# EAGLE design ML_Interface_B (EAGLE 9.2.2)
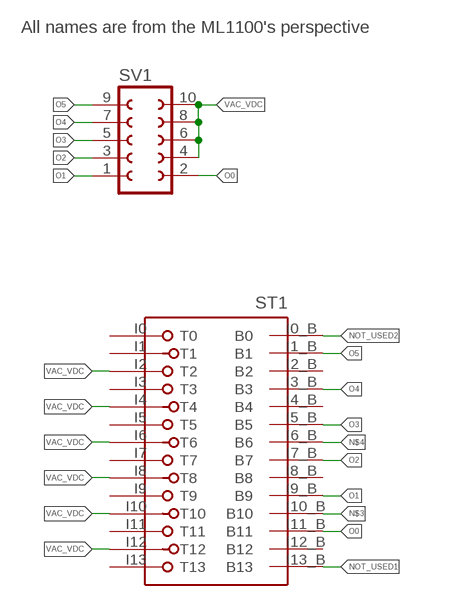
[diagram p0: schematic, sheet 1]

## Parts
ST1  ML1100_NO_POWER  [ML1100_NO_POWER]
SV1  FE05-2W  [FE05-2W]

## Nets
N$3: ST1.I10_B(B10)
N$4: ST1.I6_B(B6)
NOT_USED1: ST1.I13_B(B13)
NOT_USED2: ST1.I0_B(B0)
O0: ST1.I11_B(B11) SV1.2
O1: ST1.I9_B(B9) SV1.1
O2: ST1.I7_B(B7) SV1.3
O3: ST1.I5_B(B5) SV1.5
O4: ST1.I3_B(B3) SV1.7
O5: ST1.I1_B(B1) SV1.9
VAC_VDC: ST1.I2(T2) ST1.I4(T4) ST1.I6(T6) ST1.I8(T8) ST1.I10(T10) ST1.I12(T12) SV1.4 SV1.6 SV1.8 SV1.10
Unconnected: ST1.I0(T0) ST1.I2_B(B2) ST1.I3(T3) ST1.I4_B(B4) ST1.I5(T5) ST1.I7(T7) ST1.I8_B(B8) ST1.I9(T9) ST1.I11(T11) ST1.I13(T13)

## Notes on the sheet
- All names are from the ML1100's perspective

## Power pins joined to a net without a drawn wire
B12: ST1.I12_B(B12)
T1: ST1.I1(T1)

## Library data of the parts
ST1 = EdgCon_V1:ML1100_NO_POWER: 8-bit CARD IBM/PC-AT
SV1 = con-lsta:FE05-2W: FEMALE HEADER; OC_FARNELL: unknown; OC_NEWARK: unknown

## Net classes
0 default: width 0.203 mm
1 ground: width 0.61 mm
2 signal_out: width 0.254 mm, clearance 0.152 mm

## Board
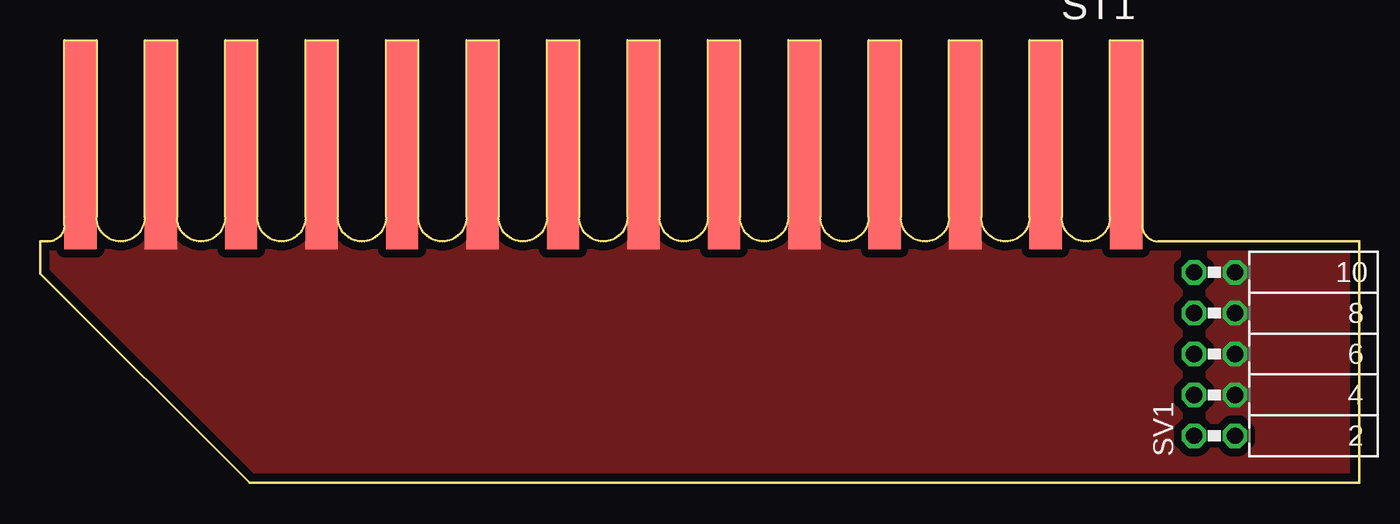
[diagram p1: board, top side]
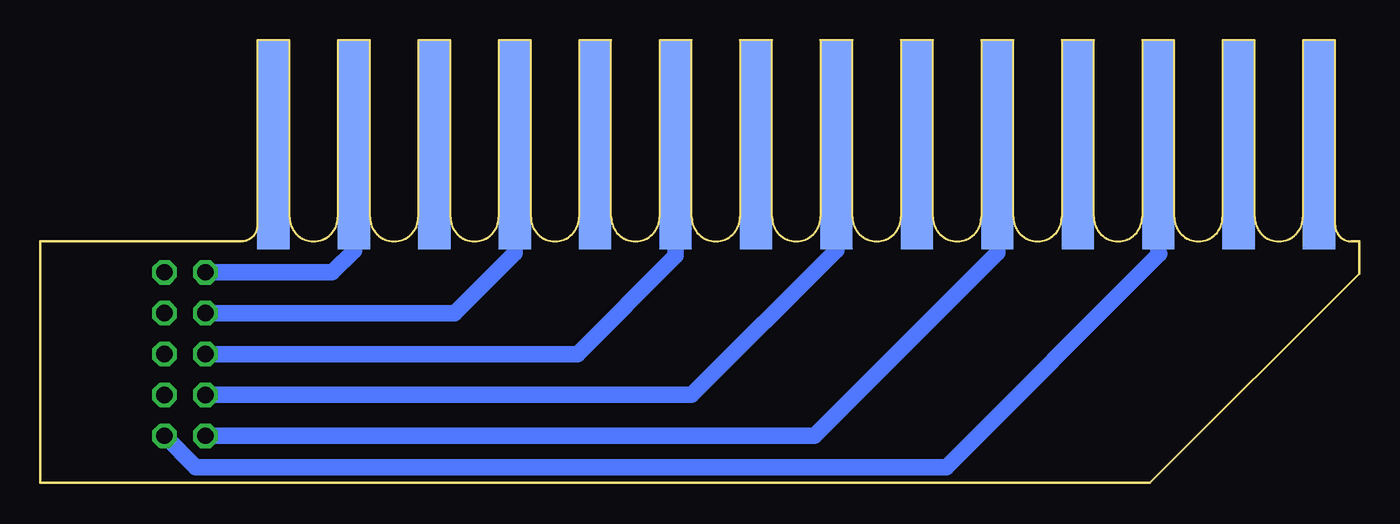
[diagram p2: board, bottom side, seen from below]

Size 82 x 27.51 mm. Coordinates in mm from the lower left corner, seen from the top.
Outline: 0.5,15.01 0,15.01 0,13.01 13.01,0 82,0 82,15.01 69.5,15.01
Copper layers (1*16): Top 0.035mm / dielectric 1.5mm / Bottom 0.035mm
Design rules "default *": minimum track width 10mil, minimum drill 0.35mm, track to track 10mil, track to pad 10mil, pad to pad 10mil, via to via 10mil, smd to smd 10mil, copper to edge 1mil, drill to drill 6mil, minimum pad ring 10mil, minimum via ring 8mil, stop-mask expansion 4mil, vias tented up to drill 0mil, thermal gap 10mil

### Footprints (pad centres in the part's own frame; a part is rotated, then mirrored left to right if it is on the bottom)
ML1100_NO_POWER = smd 2 x 13: I0 1,6.5; I1 6,6.5; I2 11,6.5; I3 16,6.5; I4 21,6.5; I5 26,6.5; I6 31,6.5; I7 36,6.5; I8 41,6.5; I9 46,6.5; I10 51,6.5; I11 56,6.5; I12 61,6.5; I13 66,6.5 | smd 2 x 13 bottom: I0_B 1,6.5; I1_B 6,6.5; I2_B 11,6.5; I3_B 16,6.5; I4_B 21,6.5; I5_B 26,6.5; I6_B 31,6.5; I7_B 36,6.5; I8_B 41,6.5; I9_B 46,6.5; I10_B 51,6.5; I11_B 56,6.5; I12_B 61,6.5; I13_B 66,6.5
FE05-2W = drill 1.016 octagon: 1 -5.08,1.27; 2 -5.08,-1.27; 3 -2.54,1.27; 4 -2.54,-1.27; 5 0,1.27; 6 0,-1.27; 7 2.54,1.27; 8 2.54,-1.27; 9 5.08,1.27; 10 5.08,-1.27

### Placement (x,y rotation side)
ST1  68.5,27.51 180 top
SV1  73,8.01 90 top

### Tracks (layer width: path | path; a pad name or v marks a point on that pad's centre or on a via)
O0
  Bottom 1.016: ST1.I11_B 12.5,14.32 12.42,14.23 25.66,0.98 72.33,0.98 SV1.2
O1
  Bottom 1.016: ST1.I9_B 22.5,14.31 33.88,2.93 SV1.1
O2
  Bottom 1.016: ST1.I7_B 32.5,14.47 41.5,5.47 SV1.3
O3
  Bottom 1.016: SV1.5 48.61,8.01 42.5,14.12 ST1.I5_B
O4
  Bottom 1.016: ST1.I3_B 52.5,14.28 56.23,10.55 SV1.7
O5
  Bottom 1.016: ST1.I1_B 62.5,14.44 63.85,13.09 SV1.9
VAC_VDC
  pour Top (isolate 0.5, no thermals): 82.01,-0.5 -1.3,-0.5 -1.3,15.25 82.01,15.25

### Text on the board
tPlace: Dist between boards: 91 mm